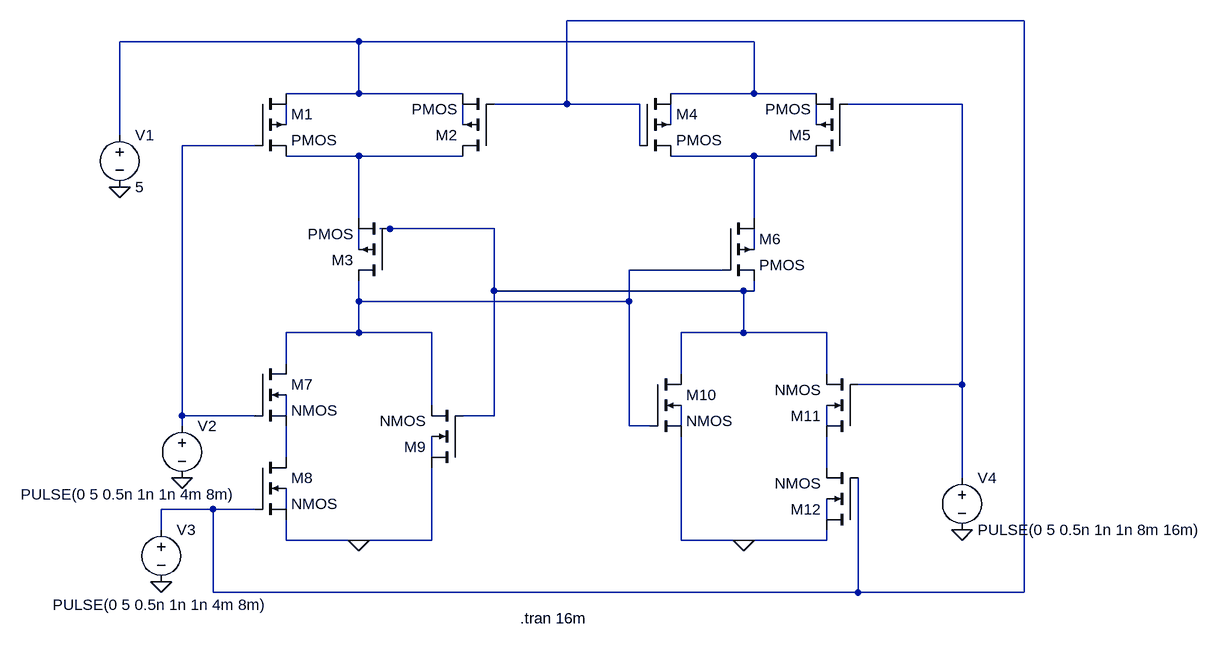
[diagram p0: schematic 12.asc]
12.asc, the LTspice schematic file:
Version 4
SHEET 1 1624 936
WIRE 1328 0 624 0
WIRE 304 32 -64 32
WIRE 912 32 304 32
WIRE 304 112 304 32
WIRE 304 112 192 112
WIRE 464 112 304 112
WIRE 912 112 912 32
WIRE 912 112 784 112
WIRE 1008 112 912 112
WIRE 624 128 624 0
WIRE 624 128 512 128
WIRE 736 128 624 128
WIRE 1232 128 1056 128
WIRE 192 160 192 128
WIRE 464 160 464 128
WIRE 784 160 784 128
WIRE 1008 160 1008 128
WIRE -64 176 -64 32
WIRE 144 192 32 192
WIRE 736 192 736 128
WIRE 304 208 192 208
WIRE 464 208 304 208
WIRE 912 208 784 208
WIRE 1008 208 912 208
WIRE 304 304 304 208
WIRE 912 304 912 208
WIRE 352 320 336 320
WIRE 512 320 352 320
WIRE 304 352 304 320
WIRE 912 352 912 320
WIRE 864 384 720 384
WIRE 512 416 512 320
WIRE 896 416 512 416
WIRE 912 416 912 400
WIRE 912 416 896 416
WIRE 304 432 304 400
WIRE 720 432 720 384
WIRE 720 432 304 432
WIRE 304 480 304 432
WIRE 304 480 192 480
WIRE 416 480 304 480
WIRE 896 480 896 416
WIRE 896 480 800 480
WIRE 1024 480 896 480
WIRE 192 528 192 480
WIRE 800 544 800 480
WIRE 1024 544 1024 480
WIRE 1232 560 1232 128
WIRE 1232 560 1072 560
WIRE 416 592 416 480
WIRE 32 608 32 192
WIRE 144 608 32 608
WIRE 192 608 192 576
WIRE 512 608 512 416
WIRE 512 608 464 608
WIRE 32 624 32 608
WIRE 720 624 720 432
WIRE 752 624 720 624
WIRE 800 624 800 592
WIRE 1024 624 1024 592
WIRE 192 672 192 624
WIRE 416 672 416 640
WIRE 1024 688 1024 640
WIRE 1232 704 1232 560
WIRE 80 752 0 752
WIRE 144 752 80 752
WIRE 192 752 192 720
WIRE 1024 768 1024 736
WIRE 0 784 0 752
WIRE 192 800 192 768
WIRE 304 800 192 800
WIRE 416 800 416 688
WIRE 416 800 304 800
WIRE 800 800 800 640
WIRE 896 800 800 800
WIRE 1024 800 1024 784
WIRE 1024 800 896 800
WIRE 80 880 80 752
WIRE 1072 880 1072 704
WIRE 1072 880 80 880
WIRE 1328 880 1328 0
WIRE 1328 880 1072 880
FLAG 304 800 0
FLAG 896 800 0
FLAG -64 256 0
FLAG 32 704 0
FLAG 0 864 0
FLAG 1232 784 0
SYMBOL pmos4 144 112 R0
SYMATTR InstName M1
SYMBOL pmos4 512 208 R180
SYMATTR InstName M2
SYMBOL pmos4 352 400 R180
SYMATTR InstName M3
SYMBOL pmos4 736 112 R0
SYMATTR InstName M4
SYMBOL pmos4 1056 208 R180
SYMATTR InstName M5
SYMBOL pmos4 864 304 R0
SYMATTR InstName M6
SYMBOL nmos4 144 528 R0
SYMATTR InstName M7
SYMBOL nmos4 144 672 R0
SYMATTR InstName M8
SYMBOL nmos4 464 688 R180
SYMATTR InstName M9
SYMBOL nmos4 752 544 R0
SYMATTR InstName M10
SYMBOL nmos4 1072 640 R180
SYMATTR InstName M11
SYMBOL nmos4 1072 784 R180
SYMATTR InstName M12
SYMBOL voltage -64 160 R0
WINDOW 123 0 0 Left 0
WINDOW 39 0 0 Left 0
SYMATTR InstName V1
SYMATTR Value 5
SYMBOL voltage 32 608 R0
WINDOW 3 -248 121 Left 2
WINDOW 123 0 0 Left 0
WINDOW 39 0 0 Left 0
SYMATTR Value PULSE(0 5 0.5n 1n 1n 4m 8m)
SYMATTR InstName V2
SYMBOL voltage 0 768 R0
WINDOW 3 -167 131 Left 2
WINDOW 123 0 0 Left 0
WINDOW 39 0 0 Left 0
SYMATTR Value PULSE(0 5 0.5n 1n 1n 4m 8m)
SYMATTR InstName V3
SYMBOL voltage 1232 688 R0
WINDOW 123 0 0 Left 0
WINDOW 39 0 0 Left 0
SYMATTR InstName V4
SYMATTR Value PULSE(0 5 0.5n 1n 1n 8m 16m)
TEXT 552 920 Left 2 !.tran 16m

The netlist it stands for:
* 12.asc
M1 N002 N008 N009 N004 PMOS
M2 N009 N001 N002 N005 PMOS
M3 N014 N011 N009 N012 PMOS
M4 N002 N001 N010 N006 PMOS
M5 N010 N003 N002 N007 PMOS
M6 N010 N014 N011 N013 PMOS
M7 N014 N008 N018 N015 NMOS
M8 N018 N001 0 N021 NMOS
M9 0 N011 N014 N019 NMOS
M10 N011 N014 0 N016 NMOS
M11 N020 N003 N011 N017 NMOS
M12 0 N001 N020 N022 NMOS
V1 N002 0 5
V2 N008 0 PULSE(0 5 0.5n 1n 1n 4m 8m)
V3 N001 0 PULSE(0 5 0.5n 1n 1n 4m 8m)
V4 N003 0 PULSE(0 5 0.5n 1n 1n 8m 16m)
.model NMOS NMOS
.model PMOS PMOS
.lib standard.mos
.tran 16m
.backanno
.end